# Altium schematic sheet EngineHeater_HW.SchDoc
size B
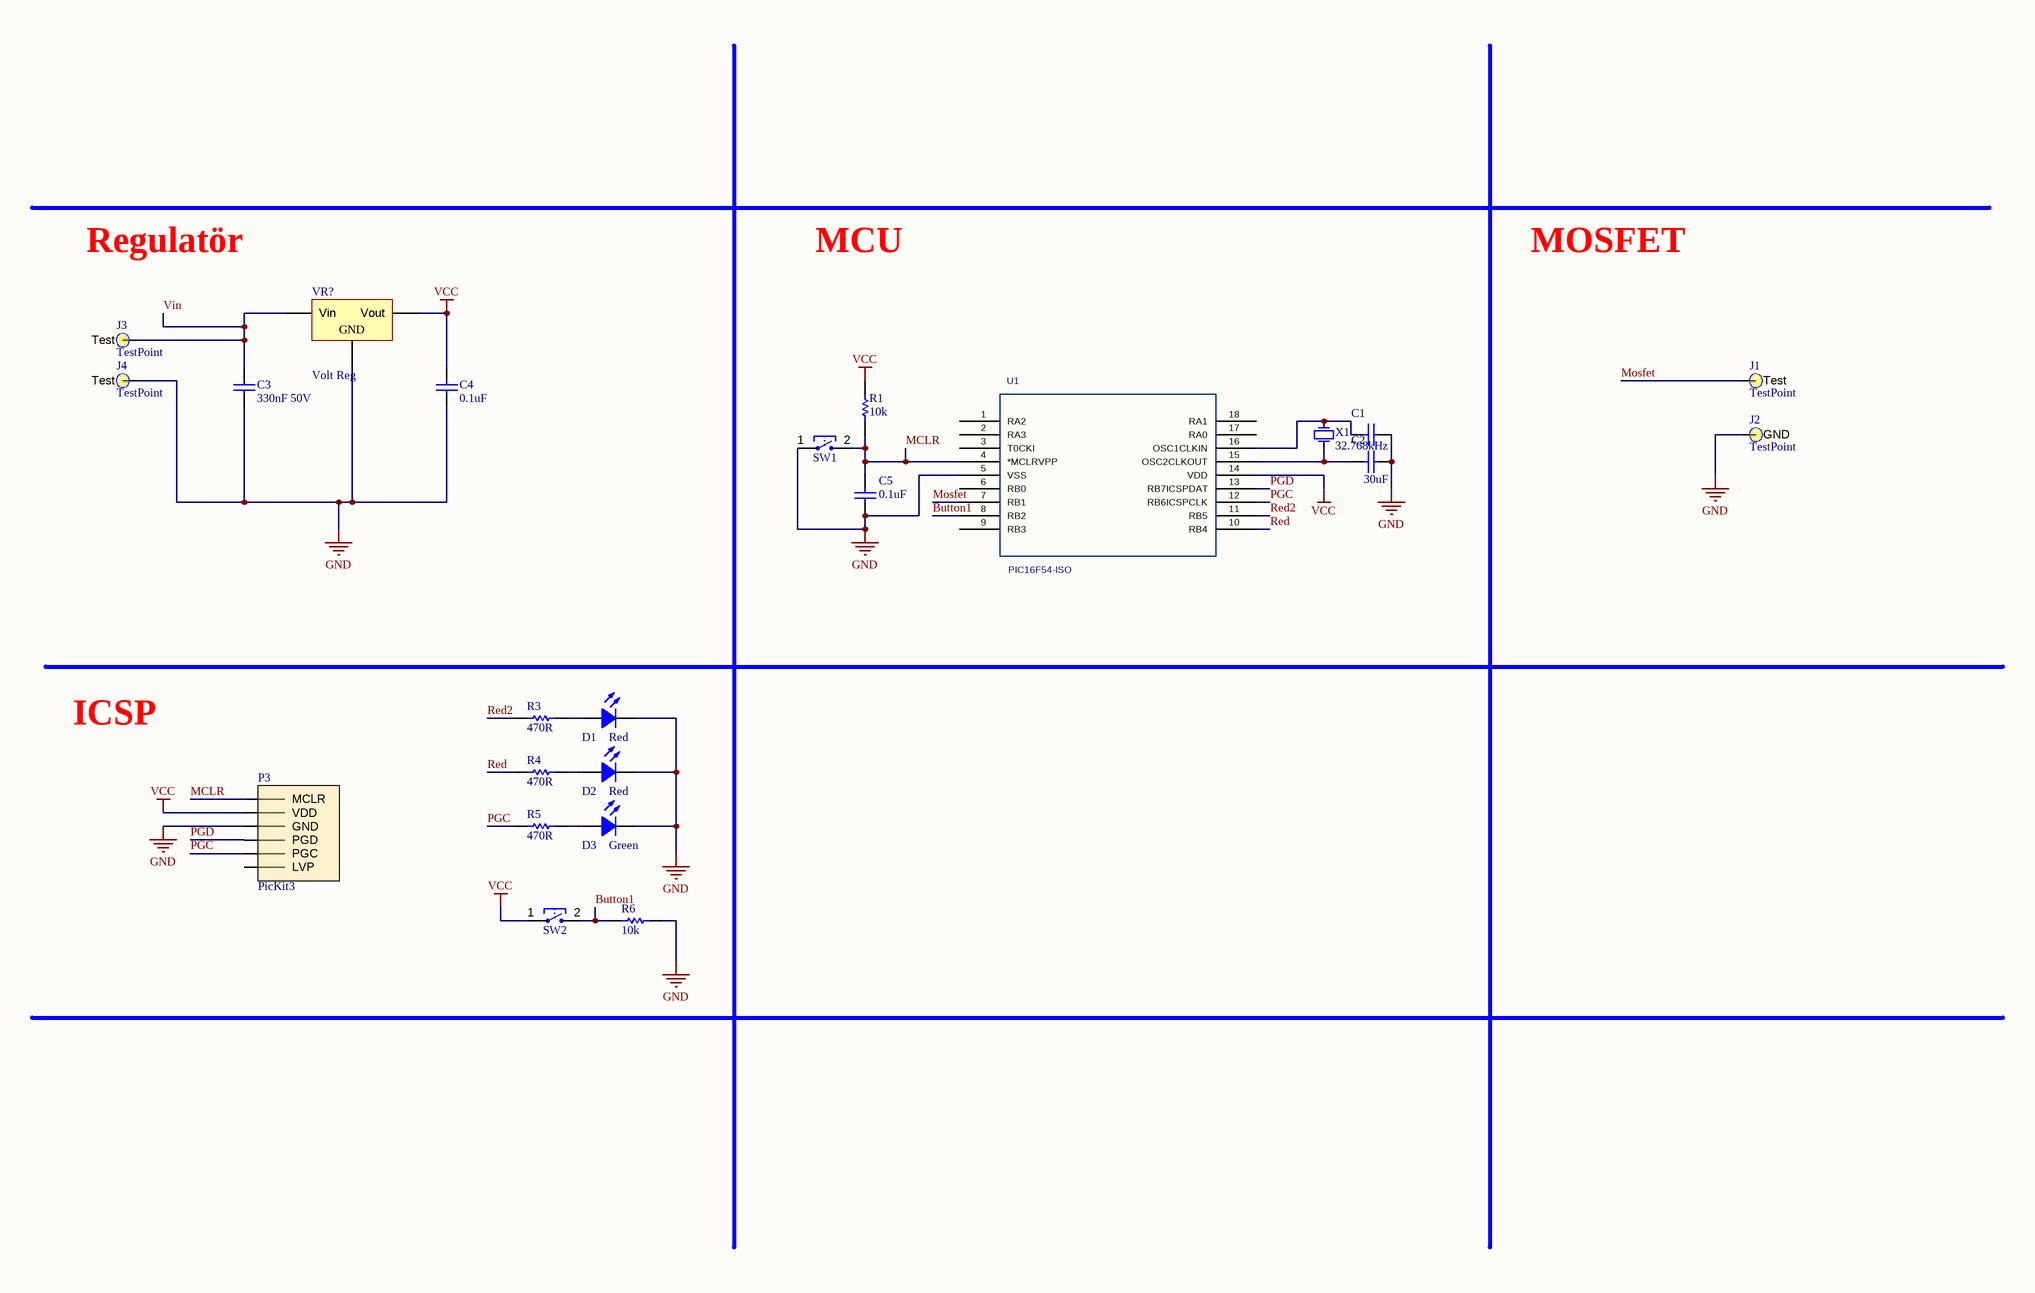
[diagram p0: EngineHeater_HW.SchDoc]

## Parts
C1  ADJ  [C-1206]  (value not drawn)
C2  30uF  [C-1206]
C3  330nF 50V  [C-1206]
C4  0.1uF  [C-1206]
C5  0.1uF  [C-1206]
D1  Red  [Diode_1206_Red]
D2  Red  [Diode_1206_Red]
D3  Green  [Diode_1206_Green]
J1  TestPoint  [Testpoint]
J2  TestPoint  [Testpoint]
J3  TestPoint  [Testpoint]
J4  TestPoint  [Testpoint]
P3  PicKit3  [PicKit3]
R1  10k  [R-1210]
R3  470R  [R-1210]
R4  470R  [R-1210]
R5  470R  [R-1210]
R6  10k  [R-1210]
SW1  2 Pin Tactile Switch  [TACT_PHAP3365R]  (value not drawn)
SW2  2 Pin Tactile Switch  [TACT_PHAP3365R]  (value not drawn)
U1  PIC16F54-ISO  [pic16f54]
VR?  Volt Reg  [D2PAK_L]
X1  32.768kHz  [HC49_SMD_A]

## Nets
GND: C1.1 C2.1 C3.1 C4.1 C5.1 D1.2(K) D2.2(K) D3.2(K) J2.1(GND) J4.1(Test) P3.3(GND) R6.1 SW1.1 U1.5(VSS) VR?.2(GND)
VCC: C4.2 P3.2(VDD) R1.2 SW2.1 U1.14(VDD) VR?.3(Vout)
Button1: R6.2 SW2.2 U1.8(RB2)
MCLR: C5.2 P3.1(MCLR) R1.1 SW1.2 U1.4(*MCLRVPP)
Mosfet: J1.1(Test) U1.7(RB1)
PGC: P3.5(PGC) R5.2 U1.12(RB6ICSPCLK)
PGD: P3.4(PGD) U1.13(RB7ICSPDAT)
Red: R4.2 U1.10(RB4)
Red2: R3.2 U1.11(RB5)
Vin: C3.2 J3.1(Test) VR?.1(Vin)
NetC1_2: C1.2 U1.16(OSC1CLKIN) X1.2(OSC2)
NetC2_2: C2.2 U1.15(OSC2CLKOUT) X1.1(OSC1)
NetD1_1: D1.1(A) R3.1
NetD2_1: D2.1(A) R4.1
NetD3_1: D3.1(A) R5.1

Not connected (* = marked no-connect by the designer): P3 6(LVP); U1 1(RA2) 2(RA3) 3(T0CKI) 6(RB0) 9(RB3) 17(RA0) 18(RA1)

## Notes on the sheet
- Regulatör
- MCU
- MOSFET
- ICSP
- DWG NO:
- REV:
- THIS DOCUMENT AND THE DATA DISCLOSED HEREIN OR
- HEREWITH IS THE PROPERTY OF ALTIUM LIMITED AND MAY
- BE FREELY DISTRIBUTED IN WHOLE. NO RIGHTS ARE
- RESERVED OR EXPRESS OR IMPLIED WARANTEE GIVEN.
- REVISION
- DESCRIPTION
- DATE
- APPROVED
- ENG:
- APPROVALS
- PROJECT
- DSN:
- CHK:
- REFERENCE DOCUMENTS
- PROJECT REVISION:
- TITLE
- DOCUMENT REVISION:
- DESIGN ITEM:
- BOM:
- FAB DWG:
- PCB DWG:
- ASSY DWG:
- SCALE:
- A2
- SIZE
- CAGE CODE
- FILE NAME
- DWG NO.
- SHEET
- OF
- REV

## Library data of the parts
C1-C5 = Capacitor
D1-D3 = LED
R1 R3-R6 = Resistor
SW1 SW2 = Tactile Switch
U1 = PIC16F54-ISO: Manufacturer_Part_Number: PIC16F54-I/SO; C: Copyright (C) 2015 Accelerated Designs. All rights reserved; Vendor: Microchip; Built_By: EMA_UL_Team; SourceLibrary: Microchip_2011-05-13; Value: PIC16F54-ISO
VR? = Volt Reg: Voltage Regulator; Published: 24-Mar-1999; LatestRevisionDate: 29-May-2009; LatestRevisionNote: IPC-7351 Footprint Added.; PackageReference: D2PAK; Publisher: Altium Limited; PackageDescription: 3-Pin Transistor Outline Package 2.54 mm Pitch, 15.1 mm Lead Span
X1 = Crystal_HC49: Crystal